# EasyEDA Pro project ProPrj_TC375_2025-11-27.epro, schematic Schematic2
Board Name: SAK; Create Date: 2025-11-21; Page Name: P1; Project Name: TC375; Schematic Name: Schematic2; Update Date: 2025-11-26; Company: 嘉立创EDA; Page Size: A4; Version: V1.0
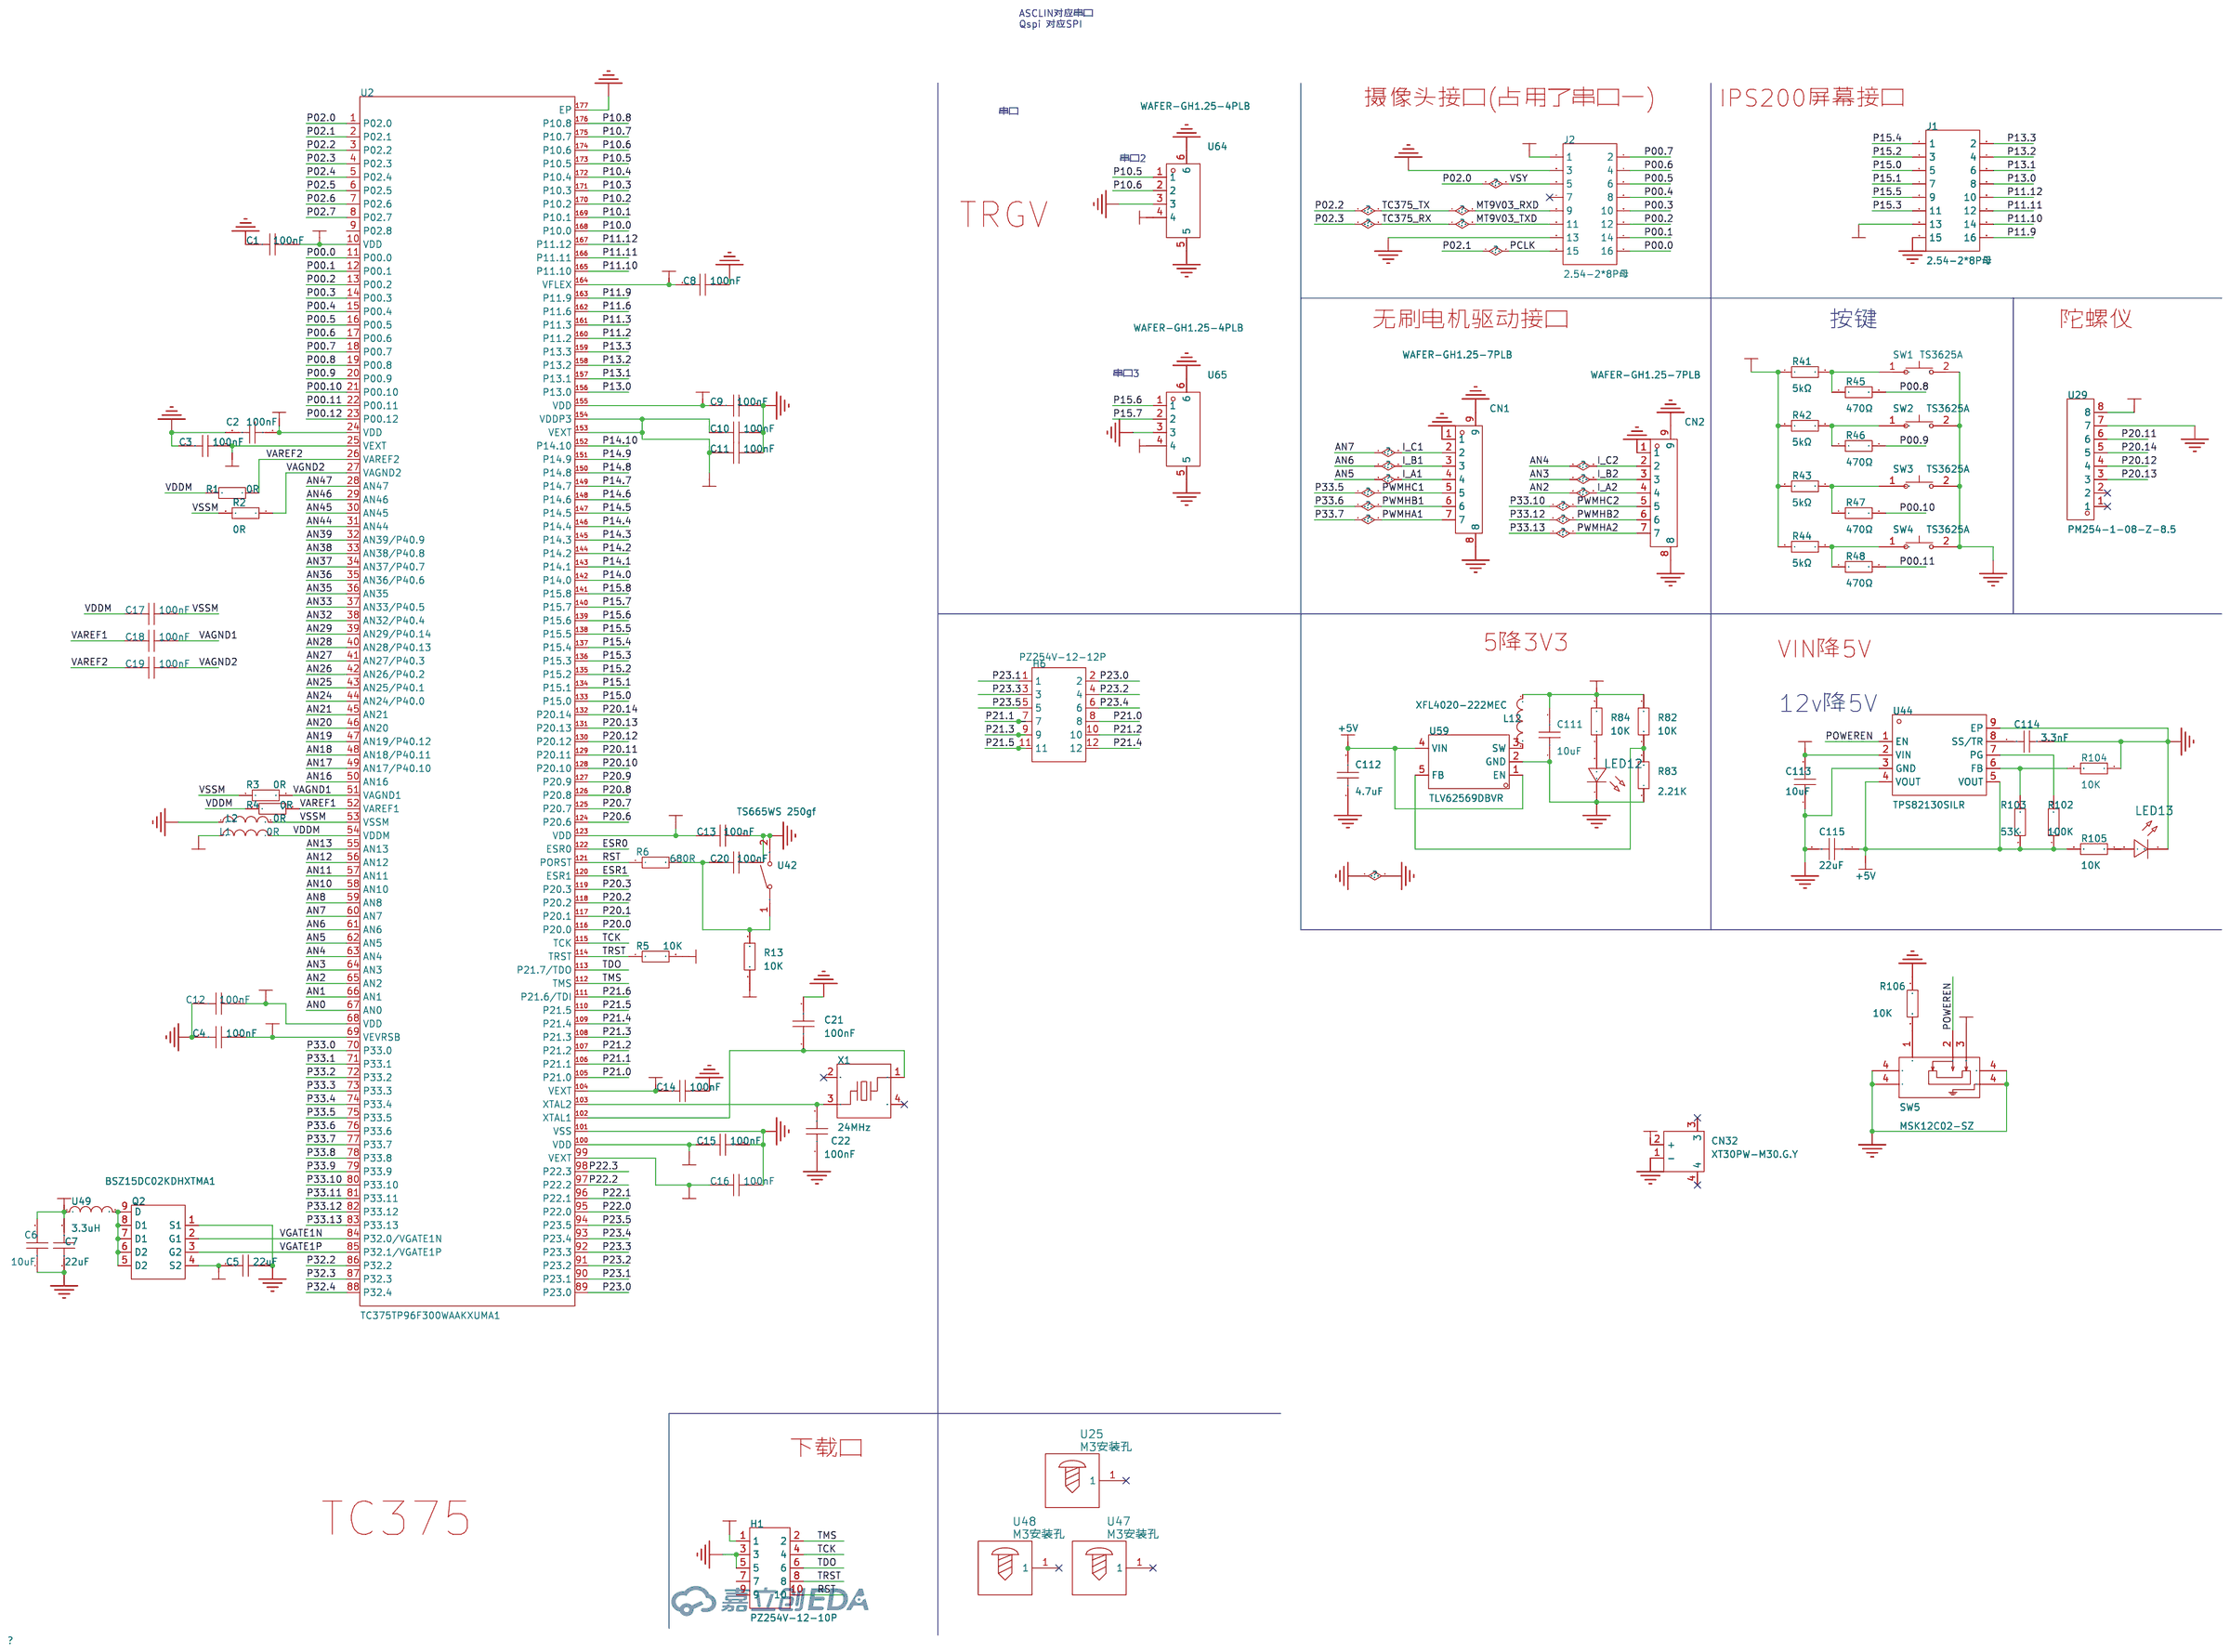
[diagram p1: schematic sheet]

## Parts
C1  100nF  [C0603]
C2  100nF  [C0603]
C3  100nF  [C0603]
C4  100nF  [C0603]
C5  22uF  [C0603]
C6  10uF  [C0603]
C7  22uF  [C0603]
C8  100nF  [C0603]
C9  100nF  [C0603]
C10  100nF  [C0603]
C11  100nF  [C0603]
C12  100nF  [C0603]
C13  100nF  [C0603]
C14  100nF  [C0603]
C15  100nF  [C0603]
C16  100nF  [C0603]
C17  100nF  [C0603]
C18  100nF  [C0603]
C19  100nF  [C0603]
C20  100nF  [C0603]
C21  100nF  [C0603]
C22  100nF  [C0603]
C111  10uF  [C0603]
C112  4.7uF  [C0603]
C113  10uF  [C0805]
C114  3.3nF  [C0603]
C115  22uF  [C0805]
CN1  WAFER-GH1.25-7PLB  [CONN-SMD_7P-P1.25_XUNPU_WAFER-GH1.25-7PLB]
CN2  WAFER-GH1.25-7PLB  [CONN-SMD_7P-P1.25_XUNPU_WAFER-GH1.25-7PLB]
CN32  XT30PW-M30.G.Y  [CONN-TH_XT30PW-M]
H1  PZ254V-12-10P  [HDR-TH_10P-P2.54-V-M-R2-C5-S2.54]
H6  PZ254V-12-12P  [HDR-TH_12P-P2.54-V-M-R2-C6-S2.54]
J1  2.54-2*8P母  [HDR-TH_16P-P2.54-V-F-R2-C8-S2.54]
J2  2.54-2*8P母  [HDR-TH_16P-P2.54-V-F-R2-C8-S2.54]
L1  0R  [L0603]
L2  0R  [L0603]
L12  XFL4020-222MEC  [IND-SMD_L4.0-W4.0_XAL4030-332MEC]
LED12  -  [LED_0603]
LED13  -  [LED_0603]
Q2  BSZ15DC02KDHXTMA1  [POWERPAK-1212-8_L3.3-W3.3-P0.65-BL-EP]
R1  0R  [R0603]
R2  0R  [R0603]
R3  0R  [R0603]
R4  0R  [R0603]
R5  10K  [R0603]
R6  680R  [R0603]
R13  10K  [R0603]
R41  5kΩ  [R0805]
R42  5kΩ  [R0805]
R43  5kΩ  [R0805]
R44  5kΩ  [R0805]
R45  470Ω  [R0805]
R46  470Ω  [R0805]
R47  470Ω  [R0805]
R48  470Ω  [R0805]
R82  10K  [R0603]
R83  2.21K  [R0603]
R84  10K  [R0603]
R102  100K  [R0603]
R103  53K  [R0603]
R104  10K  [R0603]
R105  10K  [R0603]
R106  10K  [R0603]
SW1  TS3625A  [KEY-SMD_L6.0-W3.5-LS8.4]
SW2  TS3625A  [KEY-SMD_L6.0-W3.5-LS8.4]
SW3  TS3625A  [KEY-SMD_L6.0-W3.5-LS8.4]
SW4  TS3625A  [KEY-SMD_L6.0-W3.5-LS8.4]
SW5  MSK12C02-SZ  [SW-TH_MSK12C02]
U2  TC375TP96F300WAAKXUMA1  [PG-LQFP-176_L24.0-W24.0-P0.50-LS26.0-BL-EP8.7]
U25  M3安装孔  [洞3MM]
U29  PM254-1-08-Z-8.5  [HDR-TH_8P-P2.54-V-F]
U42  TS665WS 250gf  [SW-SMD_L6.0-W6.0-LS6.6]
U44  TPS82130SILR  [USIP-8_L3.0-W2.8-P0.65-TL-EP]
U47  M3安装孔  [洞3MM]
U48  M3安装孔  [洞3MM]
U49  3.3uH  [IND-SMD_L2.0-W1.6]
U59  TLV62569DBVR  [SOT-23-5_L3.0-W1.7-P0.95-LS2.8-BR]
U64  WAFER-GH1.25-4PLB  [CONN-SMD_4P-P1.25_XUNPU_WAFER-GH1.25-4PLB]
U65  WAFER-GH1.25-4PLB  [CONN-SMD_4P-P1.25_XUNPU_WAFER-GH1.25-4PLB]
X1  24MHz  [CRYSTAL-SMD_4P-L2.0-W1.6-BL-A]

## Library data of the parts
C1-C4 C8-C22 C114 = CAP_0603: Supplier Footprint: 0603
C5 C7 = CGA0603X5R226M100JT: 容值:22uF;精度:±20%;额定电压:10V;温度系数:X5R;; LCSC Part Name: 22uF ±20% 10V; Supplier Part: C6119863; Manufacturer: HRE(芯声); Supplier Footprint: 0603; JLCPCB Part Class: 扩展库; Datasheet: https://item.szlcsc.com/datasheet/CGA0603X5R226M100JT/7062569.html; Supplier: LCSC; Tolerance: ±20%; Voltage Rating: 10V; Temperature Coefficient: X5R
C6 = CGA0603X5R106K100JT: 容值:10uF;精度:±10%;额定电压:10V;温度系数:X5R;; LCSC Part Name: 10uF ±10% 10V; Supplier Part: C6119842; Manufacturer: HRE(芯声); Supplier Footprint: 0603; JLCPCB Part Class: 扩展库; Supplier: LCSC; Tolerance: ±10%; Voltage Rating: 10V; Temperature Coefficient: X5R
C111 C112 = CAP_0805: Supplier Footprint: 0805
C113 C115 = CL21A106KAYNNNE_C15850: 容值:10uF;精度:±10%;额定电压:25V;温度系数:X5R;; LCSC Part Name: 10uF ±10% 25V; Supplier Part: C15850; Manufacturer: SAMSUNG(三星); Manufacturer Part: CL21A106KAYNNNE; Supplier Footprint: 0805; JLCPCB Part Class: 基础库; Datasheet: https://item.szlcsc.com/datasheet/CL21A106KAYNNNE/16532.html; Supplier: LCSC; Tolerance: ±10%; Voltage Rating: 25V; Temperature Coefficient: X5R
CN1 CN2 = WAFER-GH1.25-7PLB: 插针结构:1x7P;间距:1.25mm;安装方式:立贴;参考系列:GH;总PIN数:7P;排数:1;每排PIN数:7;行距:-;额定电流:1A;触头材质:黄铜;触头镀层:锡;工作温度:-25℃~+85℃;; LCSC Part Name: 1x7P 间距:1.25mm 立贴 系列:GH; Supplier Part: C3029373; Manufacturer: XUNPU(讯普); Supplier Footprint: SMD,P=1.25mm; JLCPCB Part Class: 扩展库; Datasheet: https://item.szlcsc.com/datasheet/WAFER-GH1.25-7PLB/3561385.html; Supplier: LCSC; Pins Structure: 1x7P; Pitch: 1.25mm; Mounting Type: 立贴; Reference Series: GH; Number of Pins: 7P; Number of Rows: 1; Number of PINs Per Row: 7; Current Rating: 1A; Contact Material: 黄铜; Contact Plating: 锡; Operating Temperature: -25℃~+85℃; Voltage Rating: 125V; Plastic Material: LCP; Supplementary Features: 辅助焊脚; Color: 米色; Z-Height of the Board: 4.2mm; X-Length of Bottom Edge on Board (Spacing Line): 12mm; Y-Width of Bottom Edge on Board: 4.95mm
CN32 = XT30PW-M30.G.Y: 类别:-;类型1:-;; LCSC Part Name: AMASS(艾迈斯)航模插头 卧式弯脚 XT30PW-M公头; Supplier Part: C431092; Manufacturer: AMASS(艾迈斯); JLCPCB Part Class: Extended Part; Datasheet: https://atta.szlcsc.com/upload/public/pdf/source/20220222/6A9F22F7850E25B33E1BE430ADF8560B.pdf; Supplier: LCSC; Type: 航模插头; RatedVoltage: DC 500V; InterfaceType: 公头; RatedCurrent: 15A; RecommendedWireGauge: 16/18/20AWG; contact resistance: 1.2mΩ; specifications: 2pin
H1 = PZ254V-12-10P: 插针结构:2x5P;间距:2.54mm;行距:2.54mm;圆针/方针:方针;安装方式:直插;排数:双排;总PIN位数:10P;额定电流:-;额定电压:-;配合针长度:6mm;塑高:2.5mm;端接针长度:3mm;触头材质:黄铜;触头镀层:-;工作温度:-40℃~+105℃;颜色:黑色;; LCSC Part Name: 2x5P 间距:2.54mm 方针 直插; Supplier Part: C492422; Manufacturer: XFCN(兴飞); Supplier Footprint: 插件,P=2.54mm; JLCPCB Part Class: 扩展库; Datasheet: https://item.szlcsc.com/datasheet/PZ254V-12-10P/502978.html; Supplier: LCSC; Pin Structure: 2x5P; Pitch: 2.54mm; Row Spacing: 2.54mm; Circluar Pins/Square Pins: 方针; Mounting Type: 直插; Number of Rows: 双排; Number of Pins: 10P; Length of Mating Pin: 6mm; Insulation Height: 2.5mm; Length of End Connection Pin: 3mm; Contact Material: 黄铜; Operating Temperature: -40℃~+105℃; Color: 黑色
H6 = PZ254V-12-12P: 插针结构:2x6P;间距:2.54mm;行距:2.54mm;圆针/方针:方针;安装方式:直插;排数:双排;总PIN位数:12P;额定电流:-;额定电压:-;配合针长度:6mm;塑高:2.5mm;端接针长度:3mm;触头材质:黄铜;触头镀层:-;工作温度:-40℃~+105℃;颜色:黑色;; LCSC Part Name: 2x6P 间距:2.54mm 方针 直插; Supplier Part: C492423; Manufacturer: XFCN(兴飞); Supplier Footprint: 插件,P=2.54mm; JLCPCB Part Class: 扩展库; Datasheet: https://item.szlcsc.com/datasheet/PZ254V-12-12P/502979.html; Supplier: LCSC; Pin Structure: 2x6P; Pitch: 2.54mm; Row Spacing: 2.54mm; Circluar Pins/Square Pins: 方针; Mounting Type: 直插; Number of Rows: 双排; Number of Pins: 12P; Length of Mating Pin: 6mm; Insulation Height: 2.5mm; Length of End Connection Pin: 3mm; Contact Material: 黄铜; Operating Temperature: -40℃~+105℃; Color: 黑色
J1 J2 = 2.54-2*8P母: 插孔结构:2x8P;间距:2.54mm;行距:2.54mm;圆孔/方孔:方孔;安装方式:直插;排数:双排;总孔位数:16P;插孔方向:顶部;塑高:-;触头材质:黄铜;触头镀层:-;; LCSC Part Name: 2x8P 间距:2.54mm 直插; Supplier Part: C30734; Manufacturer: BOOMELE(博穆精密); Supplier Footprint: 插件,P=2.54mm; JLCPCB Part Class: 扩展库; Datasheet: https://item.szlcsc.com/datasheet/2.54-2*8P%25E6%25AF%258D/31491.html; Supplier: LCSC; Holes Structure: 2x8P; Pitch: 2.54mm; Row Spacing: 2.54mm; Circular Hole / Square Hole: 方孔; Mounting Type: 直插; Number of Rows: 双排; Number of Positions: 16P; Holes Direction: 顶部; Contact Material: 黄铜
L1 L2 = CBG160808U000T: 阻抗@频率:0Ω@100MHz;直流电阻(DCR):100mΩ;; LCSC Part Name: 单路 0603磁珠 阻抗0Ω@100MHz; Supplier Part: C43163; Manufacturer: FH(风华); Supplier Footprint: 0603; JLCPCB Part Class: 扩展库; Datasheet: https://item.szlcsc.com/datasheet/CBG160808U000T/44154.html; Supplier: LCSC; Impedance @ Frequency: 0Ω@100MHz; DC Resistance(DCR): 100mΩ; Current Rating: 800mA; Number of Circuits: 1; Operating Temperature: -40℃~+85℃
L12 = XFL4020-222MEC: Supplier Part: C9900010220; Supplier Footprint: SMD_4040; JLCPCB Part Class: 扩展库; Datasheet: https://atta.szlcsc.comnull; Supplier: LCSC
LED12 LED13 = LED_0603-R: Supplier Footprint: 0603
Q2 = BSZ15DC02KDHXTMA1: 数量:1个N沟道+1个P沟道;漏源电压(Vdss):20V;连续漏极电流(Id):3.2A；5.1A;导通电阻(RDS(on)):150mΩ@4.5V；55mΩ@4.5V;耗散功率(Pd):2.5W;阈值电压(Vgs(th)):1V@110uA；1.1V@110uA;; LCSC Part Name: 1个N沟道+1个P沟道 耐压:20V 电流:5.1A; Supplier Part: C3279308; Manufacturer: Infineon(英飞凌); Supplier Footprint: TSDSON-8; JLCPCB Part Class: 扩展库; Datasheet: https://item.szlcsc.com/datasheet/BSZ15DC02KDHXTMA1/3842206.html; Supplier: LCSC; Number: 1个N沟道+1个P沟道; Drain to Source Voltage: 20V; Current - Continuous Drain(Id): 3.2A；5.1A; RDS(on): 150mΩ@4.5V；55mΩ@4.5V; Pd - Power Dissipation: 2.5W; Gate Threshold Voltage (Vgs(th)): 1V@110uA；1.1V@110uA; Gate Charge(Qg): 3nC@4.5V；2.1nC@4.5V; Input Capacitance(Ciss): 270pF；315pF; Reverse Transfer Capacitance (Crss@Vds): 94pF；16pF; Operating Temperature: -55℃~+175℃; Type: N沟道+P沟道; Output Capacitance(Coss): 110pF；114pF
R1-R6 R13 R82-R84 R102-R106 = Res_0603: Supplier Footprint: 0603
R41-R44 = TC0525B5001T5E: 电阻类型:薄膜电阻;阻值:5kΩ;精度:±0.1%;功率:250mW;工作电压:150V;温度系数:±25ppm/℃;; LCSC Part Name: 5kΩ ±0.1% 250mW 薄膜电阻 非标阻值; Supplier Part: C78980; Manufacturer: UNI-ROYAL(厚声); Supplier Footprint: 0805; JLCPCB Part Class: 扩展库; Datasheet: https://atta.szlcsc.com/upload/public/pdf/source/20190904/C425668_F2F639A313B6F33D501F342892FD5229.pdf; Supplier: LCSC; Type: 薄膜电阻; Tolerance: ±0.1%; Power(Watts): 250mW; Voltage-Supply(Max): 150V; Temperature Coefficient: ±25ppm/℃; Operating Temperature: -55℃~+155℃
R45-R48 = 0805W8F4700T5E: 电阻类型:厚膜电阻;阻值:470Ω;精度:±1%;功率:125mW;最大工作电压:150V;温度系数:±100ppm/℃;; LCSC Part Name: 470Ω ±1% 125mW 厚膜电阻; Supplier Part: C17710; Manufacturer: UNI-ROYAL(厚声); Supplier Footprint: 0805; JLCPCB Part Class: 基础库; Datasheet: https://atta.szlcsc.com/upload/public/pdf/source/20200306/C422600_1E6D84923E4A46A82E41ADD87F860B5C.pdf; Supplier: LCSC; Type: 厚膜电阻; Tolerance: ±1%; Power(Watts): 125mW; Overload Voltage (Max): 150V; Temperature Coefficient: ±100ppm/℃; Operating Temperature Range: -55℃~+155℃
SW1-SW4 = TS3625A: 电路结构:单刀单掷;按钮形状:矩形按钮;作用力:250gf;安装方式:立贴;开关长度:6.1mm;开关宽度:3.65mm;开关高度:2.5mm;触点电流:50mA;额定电压(DC):12V;带灯:-;机械寿命:-;; LCSC Part Name: 6.1*3.65*2.5mm 立贴 轻触开关; Supplier Part: C398053; Manufacturer: SHOU HAN(首韩); Supplier Footprint: SMD; JLCPCB Part Class: 扩展库; Datasheet: https://atta.szlcsc.com/upload/public/pdf/source/20190620/C398053_EFFFB524A3F966B1F45EE8333D1EDECC.pdf; Supplier: LCSC; Circuit: 单刀单掷; Actuator Style: 矩形按钮; Operating Force: 250gf; Mounting Style: 立贴; Switch Length: 6.1mm; Switch Width: 3.65mm; Switch Height: 2.5mm; Contact Current: 50mA; Voltage Rating (DC): 12V
SW5 = MSK12C02-SZ: 电路结构:单刀双掷;安装方式:卧贴;开关颜色:-;额定电流:50mA;额定电压:12V;工作寿命:1万次;; LCSC Part Name: 迷你贴片拨动/两档侧拨 7脚 白柄，柄长1.5mm,耐温，高品质带金属丝; Supplier Part: C2681568; Manufacturer: SHOU HAN(首韩); Supplier Footprint: SMD,8x2.8mm; JLCPCB Part Class: 扩展库; Datasheet: https://item.szlcsc.com/datasheet/MSK12C02-SZ/2774911.html; Supplier: LCSC; Circuit: 单刀双掷; Termination Style: SMD接片; Length: 8mm; Width: 2.8mm; Switch Height: 1.4mm; Mounting Type: 卧贴; Current Rating: 50mA; Voltage Rating: 12V; Life: 1万次; Operating Temperature: -20℃~+70℃
U2 = TC375TP96F300WAAKXUMA1: CPU内核:其他系列;CPU最大主频:300MHz;应用领域:-;; Supplier Part: C1854996; Manufacturer: Infineon(英飞凌); Supplier Footprint: LQFP-176-EP(24x24); JLCPCB Part Class: Extended Part; Datasheet: https://item.szlcsc.com/datasheet/TC375TP96F300WAAKXUMA1/1945809.html; Supplier: LCSC; CPU Core: 其他系列; CPU Maximum Speed: 300MHz; Program Storage Size: 6MB; Program Memory Type: FLASH
U25 U47 U48 = M3安装孔
U29 = PM254-1-08-Z-8.5: 插孔结构:1x8P;间距:2.54mm;行距:-;圆孔/方孔:方孔;安装类型:直插;排数:单排;总孔位数:8P;额定电流:3A;额定电压:-;插孔方向:顶部;塑高:8.5mm;触头材质:铜合金;工作温度范围:-40℃~+105℃;焊接温度(最大值):260℃@5S;; LCSC Part Name: 1x8P 间距:2.54mm 直插; Supplier Part: C2897371; Manufacturer: HCTL(华灿天禄); Supplier Footprint: 插件,P=2.54mm; JLCPCB Part Class: 扩展库; Datasheet: https://atta.szlcsc.com/upload/public/pdf/source/20230609/534BE42964C679BDE98E061007C4ABD6.pdf; Supplier: LCSC; Holes Structure: 1x8P; Pitch: 2.54mm; Circular Hole / Square Hole: 方孔; Mounting Type: 直插; Number of Rows: 单排; Number of Holes: 8P; Current Rating (Max): 3A; Holes Direction: 顶部; Insulation Height: 8.5mm; Contact Material: 铜合金; Operating Temperature Range: -40℃~+105℃; Soldering Temperature(Max): 260℃@5S
U42 = TS665WS 250gf: 电路结构:单刀单掷;按钮形状:圆形按钮;作用力:250gf;安装方式:立贴;开关长度:6mm;开关宽度:6mm;开关高度:5mm;带支架:不带;触点电流:50mA;额定电压(DC):12V;额定功率:0.6W;绝缘电阻:100MΩ;带灯:无;机械寿命:10万次;; LCSC Part Name: 无声按键开关 6*6*5mm 250G; Supplier Part: C6798384; Manufacturer: SHOU HAN(首韩); Supplier Footprint: SMD; JLCPCB Part Class: 扩展库; Datasheet: https://atta.szlcsc.com/upload/public/pdf/source/20230621/9BA9DAAFF61506696103CF7691F2BF59.pdf; Supplier: LCSC; Circuit: 单刀单掷; Actuator Style: 圆形按钮; Operating Force: 250gf; Mounting Style: 立贴; Switch Length: 6mm; Switch Width: 6mm; Switch Height: 5mm; Strike Gundam: 不带; Contact Current: 50mA; Voltage Rating (DC): 12V; Power Rating: 0.6W; Insulation Resistance: 100MΩ; Actuator/Cap Color: 黑色; With Lamp: 无; Mechanical Life: 10万次; Operating Temperature: -40℃~+80℃
U44 = TPS82130SILR: TPS82130 TPS82130 具有集成电感的 3A 17V 降压转换器; LCSC Part Name: 带集成电感的17V输入、3A降压转换器MicroSiP模块; Supplier Part: C473914; Manufacturer: TI(德州仪器); Supplier Footprint: USIP-8; JLCPCB Part Class: 扩展库; Datasheet: https://www.ti.com/cn/lit/gpn/tps82130; Supplier: LCSC; Function: 降压型; Number of Outputs: 1; Voltage - Supply: 3V~17V; Output Voltage Accuracy: ±1.5%; Output Voltage: 900mV~6V; Output Current(Max): 3A; Supply Current (Iq): 20uA; Switching Frequency: 2MHz; Features: 过热保护; Length: 3mm; Width: 2.8mm; Height: 1.5mm; Operating Temperature Range: -40℃~+125℃
U49 = APH201610T3R3M: 电感值:3.3uH;精度:±20%;额定电流:1.5A;饱和电流(Isat):2A;类型:一体成型电感;; LCSC Part Name: 3.3uH ±20% 2A 2x1.6x1mm; Supplier Part: C5349598; Manufacturer: APV(爱普微); Supplier Footprint: 0806; JLCPCB Part Class: 扩展库; Datasheet: https://item.szlcsc.com/datasheet/APH201610T3R3M/6135013.html; Supplier: LCSC; Tolerance: ±20%; Current Rating: 1.5A; Current - Saturation(Isat): 2A; DC Resistance(DCR): 180mΩ; Type: 一体成型电感
U59 = TLV62569DBVR: 功能类型:降压型;输出类型:可调;输入电压:2.5V~5.5V;输出电压:600mV~5.5V;输出电流(最大值):2A;; LCSC Part Name: 降压型 输入2.5V~5.5V 输出600mV~5.5V 2A; Supplier Part: C141836; Manufacturer: TI(德州仪器); Supplier Footprint: SOT-23-5; JLCPCB Part Class: 扩展库; Datasheet: https://atta.szlcsc.com/upload/public/pdf/source/20180423/C141836_1FC17A3D2C2E4ECD339DF92B83CED618.pdf; Supplier: LCSC; Function: 降压型; Synchronous Rectification: 是; Output Type: 可调; Topology: 降压式; Input Voltage: 2.5V~5.5V; Output Voltage: 600mV~5.5V; Output Current (Max): 2A; Switching Frequency: 1.5MHz; Operating Temperature: -40℃~+125℃@(TJ)
U64 U65 = WAFER-GH1.25-4PLB: 插针结构:1x4P;间距:1.25mm;安装方式:立贴;参考系列:GH;总PIN数:4P;排数:1;每排PIN数:4;行距:-;额定电流:1A;触头材质:黄铜;触头镀层:锡;工作温度:-25℃~+85℃;; LCSC Part Name: 1x4P 间距:1.25mm 立贴 系列:GH; Supplier Part: C3029370; Manufacturer: XUNPU(讯普); Supplier Footprint: SMD,P=1.25mm; JLCPCB Part Class: 扩展库; Datasheet: https://item.szlcsc.com/datasheet/WAFER-GH1.25-4PLB/3561382.html; Supplier: LCSC; Pins Structure: 1x4P; Pitch: 1.25mm; Mounting Type: 立贴; Reference Series: GH; Number of Pins: 4P; Number of Rows: 1; Number of PINs Per Row: 4; Current Rating: 1A; Contact Material: 黄铜; Contact Plating: 锡; Operating Temperature: -25℃~+85℃; Voltage Rating: 125V; Plastic Material: LCP; Supplementary Features: 辅助焊脚; Color: 米色; Z-Height of the Board: 4.2mm; X-Length of Bottom Edge on Board (Spacing Line): 8.25mm; Y-Width of Bottom Edge on Board: 4.95mm
X1 = XL7EL89CKI-111YLC-24M: 晶振类型:贴片晶振;频率:24MHz;常温频差:±10ppm;负载电容:8pF;频率稳定度:±20ppm;; LCSC Part Name: YSX211SL 24MHZ 4P 2016 8PF ±10PPM -40~85℃ (±20PPM); Supplier Part: C2965580; Manufacturer: YXC(扬兴晶振); Supplier Footprint: SMD2016-4P; JLCPCB Part Class: 扩展库; Datasheet: https://item.szlcsc.com/datasheet/XL7EL89CKI-111YLC-24M/3357716.html; Supplier: LCSC; Type: 贴片晶振; Normal temperature Frequency Tolerance: ±10ppm; Load Capacitance: 8pF; Frequency Stability: ±20ppm; Operating Temperature: -40℃~+85℃

## Nets
+5V: C112.2 C115.1 R102.1 R103.1 R105.2 U29.8 U44.4(VOUT) U44.5(VOUT) U59.1(EN) U59.4(VIN)
GND: C1.1 C2.1 C3.1 C4.1 C5.2 C6.1 C7.1 C8.1 C9.1 C10.1 C11.1 C12.1 C13.1 C14.1 C15.1 C16.1 C20.1 C21.2 C22.1 C111.1 C112.1 C113.1 C114.1 C115.2 CN1.1 CN1.8 CN1.9 CN2.1 CN2.8 CN2.9 CN32.1(-) H1.3 H1.5 J1.15 J2.3 J2.13 L2.1 LED12.1(C) LED13.1(C) Q2.1(S1) R83.1 R104.1 R106.1 SW1.2 SW2.2 SW3.2 SW4.2 SW5.4 U2.101(VSS) U2.177(EP) U29.7 U42.2(B) U44.3(GND) U44.9(EP) U59.2(GND) U64.3 U64.5 U64.6 U65.3 U65.5 U65.6
VCC1V25: C1.2 C2.2 C6.2 C7.2 C9.2 C12.2 C13.2 C15.2 U2.10(VDD) U2.24(VDD) U2.68(VDD) U2.100(VDD) U2.123(VDD) U2.155(VDD) U49.1
VCC3V3: C3.2 C4.2 C5.1 C8.2 C10.2 C11.2 C14.2 C16.2 C111.2 H1.1 J1.13 J2.1 L1.1 L12.1 Q2.4(S2) R5.2 R13.2 R41.1 R42.1 R43.1 R44.1 R82.2 R84.2 U2.25(VEXT) U2.69(VEVRSB) U2.99(VEXT) U2.104(VEXT) U2.153(VEXT) U2.154(VDDP3) U2.164(VFLEX) U64.4 U65.4
VDDM: C17.1 L1.2 R1.2 R4.1 U2.54(VDDM)
VIN: C113.2 CN32.2(+) SW5.3 U44.2(VIN)
VSSM: C17.2 L2.2 R2.2 R3.1 U2.53(VSSM)
AN0: U2.67(AN0)
AN1: U2.66(AN1)
AN2: CN2.4 U2.65(AN2)
AN3: CN2.3 U2.64(AN3)
AN4: CN2.2 U2.63(AN4)
AN5: CN1.4 U2.62(AN5)
AN6: CN1.3 U2.61(AN6)
AN7: CN1.2 U2.60(AN7)
AN8: U2.59(AN8)
AN10: U2.58(AN10)
AN11: U2.57(AN11)
AN12: U2.56(AN12)
AN13: U2.55(AN13)
AN16: U2.50(AN16)
AN17: U2.49(AN17/P40.10)
AN18: U2.48(AN18/P40.11)
AN19: U2.47(AN19/P40.12)
AN20: U2.46(AN20)
AN21: U2.45(AN21)
AN24: U2.44(AN24/P40.0)
AN25: U2.43(AN25/P40.1)
AN26: U2.42(AN26/P40.2)
AN27: U2.41(AN27/P40.3)
AN28: U2.40(AN28/P40.13)
AN29: U2.39(AN29/P40.14)
AN32: U2.38(AN32/P40.4)
AN33: U2.37(AN33/P40.5)
AN35: U2.36(AN35)
AN36: U2.35(AN36/P40.6)
AN37: U2.34(AN37/P40.7)
AN38: U2.33(AN38/P40.8)
AN39: U2.32(AN39/P40.9)
AN44: U2.31(AN44)
AN45: U2.30(AN45)
AN46: U2.29(AN46)
AN47: U2.28(AN47)
ESR0: U2.122(ESR0)
ESR1: U2.120(ESR1)
MT9V03_RXD: J2.9 U2.3(P02.2)
MT9V03_TXD: J2.11 U2.4(P02.3)
P00.0: J2.16 U2.11(P00.0)
P00.1: J2.14 U2.12(P00.1)
P00.2: J2.12 U2.13(P00.2)
P00.3: J2.10 U2.14(P00.3)
P00.4: J2.8 U2.15(P00.4)
P00.5: J2.6 U2.16(P00.5)
P00.6: J2.4 U2.17(P00.6)
P00.7: J2.2 U2.18(P00.7)
P00.8: R45.2 U2.19(P00.8)
P00.9: R46.2 U2.20(P00.9)
P00.10: R47.2 U2.21(P00.10)
P00.11: R48.2 U2.22(P00.11)
P00.12: U2.23(P00.12)
P02.0: J2.5 U2.1(P02.0)
P02.1: J2.15 U2.2(P02.1)
P02.4: U2.5(P02.4)
P02.5: U2.6(P02.5)
P02.6: U2.7(P02.6)
P02.7: U2.8(P02.7)
P10.0: U2.168(P10.0)
P10.1: U2.169(P10.1)
P10.2: U2.170(P10.2)
P10.3: U2.171(P10.3)
P10.4: U2.172(P10.4)
P10.5: U2.173(P10.5) U64.1
P10.6: U2.174(P10.6) U64.2
P10.7: U2.175(P10.7)
P10.8: U2.176(P10.8)
P11.2: U2.160(P11.2)
P11.3: U2.161(P11.3)
P11.6: U2.162(P11.6)
P11.9: J1.16 U2.163(P11.9)
P11.10: J1.14 U2.165(P11.10)
P11.11: J1.12 U2.166(P11.11)
P11.12: J1.10 U2.167(P11.12)
P13.0: J1.8 U2.156(P13.0)
P13.1: J1.6 U2.157(P13.1)
P13.2: J1.4 U2.158(P13.2)
P13.3: J1.2 U2.159(P13.3)
P14.0: U2.142(P14.0)
P14.1: U2.143(P14.1)
P14.2: U2.144(P14.2)
P14.3: U2.145(P14.3)
P14.4: U2.146(P14.4)
P14.5: U2.147(P14.5)
P14.6: U2.148(P14.6)
P14.7: U2.149(P14.7)
P14.8: U2.150(P14.8)
P14.9: U2.151(P14.9)
P14.10: U2.152(P14.10)
P15.0: J1.5 U2.133(P15.0)
P15.1: J1.7 U2.134(P15.1)
P15.2: J1.3 U2.135(P15.2)
P15.3: J1.11 U2.136(P15.3)
P15.4: J1.1 U2.137(P15.4)
P15.5: J1.9 U2.138(P15.5)
P15.6: U2.139(P15.6) U65.1
P15.7: U2.140(P15.7) U65.2
P15.8: U2.141(P15.8)
P20.0: U2.116(P20.0)
P20.1: U2.117(P20.1)
P20.2: U2.118(P20.2)
P20.3: U2.119(P20.3)
P20.6: U2.124(P20.6)
P20.7: U2.125(P20.7)
P20.8: U2.126(P20.8)
P20.9: U2.127(P20.9)
P20.10: U2.128(P20.10)
P20.11: U2.129(P20.11) U29.6
P20.12: U2.130(P20.12) U29.4
P20.13: U2.131(P20.13) U29.3
P20.14: U2.132(P20.14) U29.5
P21.0: H6.8 U2.105(P21.0)
P21.1: H6.7 U2.106(P21.1)
P21.2: H6.10 U2.107(P21.2)
P21.3: H6.9 U2.108(P21.3)
P21.4: H6.12 U2.109(P21.4)
P21.5: H6.11 U2.110(P21.5)
P21.6: U2.111(P21.6/TDI)
P22.0: U2.95(P22.0)
P22.1: U2.96(P22.1)
P22.2: U2.97(P22.2)
P22.3: U2.98(P22.3)
P23.0: H6.2 U2.89(P23.0)
P23.1: H6.1 U2.90(P23.1)
P23.2: H6.4 U2.91(P23.2)
P23.3: H6.3 U2.92(P23.3)
P23.4: H6.6 U2.93(P23.4)
P23.5: H6.5 U2.94(P23.5)
P32.2: U2.86(P32.2)
P32.3: U2.87(P32.3)
P32.4: U2.88(P32.4)
P33.0: U2.70(P33.0)
P33.1: U2.71(P33.1)
P33.2: U2.72(P33.2)
P33.3: U2.73(P33.3)
P33.4: U2.74(P33.4)
P33.5: CN1.5 U2.75(P33.5)
P33.6: CN1.6 U2.76(P33.6)
P33.7: CN1.7 U2.77(P33.7)
P33.8: U2.78(P33.8)
P33.9: U2.79(P33.9)
P33.10: CN2.5 U2.80(P33.10)
P33.11: U2.81(P33.11)
P33.12: CN2.6 U2.82(P33.12)
P33.13: CN2.7 U2.83(P33.13)
POWEREN: SW5.2 U44.1(EN)
RST: H1.10 R6.1 U2.121(PORST)
TCK: H1.4 U2.115(TCK)
TDO: H1.6 U2.113(P21.7/TDO)
TMS: H1.2 U2.112(TMS)
TRST: H1.8 R5.1 U2.114(TRST)
VAGND1: C18.2 R3.2 U2.51(VAGND1)
VAGND2: C19.2 R2.1 U2.27(VAGND2)
VAREF1: C18.1 R4.2 U2.52(VAREF1)
VAREF2: C19.1 R1.1 U2.26(VAREF2)
VGATE1N: Q2.2(G1) U2.84(P32.0/VGATE1N)
VGATE1P: Q2.3(G2) U2.85(P32.1/VGATE1P)
$1N1853: Q2.5(D2) Q2.6(D2) Q2.7(D1) Q2.8(D1) Q2.9(D) U49.2
$1N2077: C21.1 U2.102(XTAL1) X1.1
$1N2089: C22.2 U2.103(XTAL2) X1.3
$1N11464: L12.2 U59.3(SW)
$1N11467: R82.1 R83.2 U59.5(FB)
$1N11468: LED12.2(A) R84.1
$1N18086: R41.2 R45.1 SW1.1
$1N18087: R42.2 R46.1 SW2.1
$1N18088: R44.2 R48.1 SW4.1
$1N18089: R43.2 R47.1 SW3.1
$1N21170: C114.2 U44.8(SS/TR)
$1N21171: R102.2 U44.7(PG)
$1N21172: R103.2 R104.2 U44.6(FB)
$1N21174: LED13.2(A) R105.1
$1N22434: R106.2 SW5.1
$1N22519: C20.2 R6.2 R13.1 U42.1(A)

Not connected (* = marked no-connect by the designer): CN32 3* 4*; H1 7 9; J2 7*; U2 9(P02.8); U25 1*; U29 1* 2*; U47 1*; U48 1*; X1 2(GND)* 4(GND)*

## Notes on the sheet
- ASCLIN对应串口
  Qspi 对应SPI
- 摄像头接口(占用了串口一)
- IPS200屏幕接口
- 串口
- 串口2
- TRGV
- 无刷电机驱动接口
- 按键
- 陀螺仪
- 串口3
- 5降3V3
- VIN降5V
- 12v降5V
- 下载口
- TC375
